# Altium project nrf52805_caaa_dcdc.PrjPCB
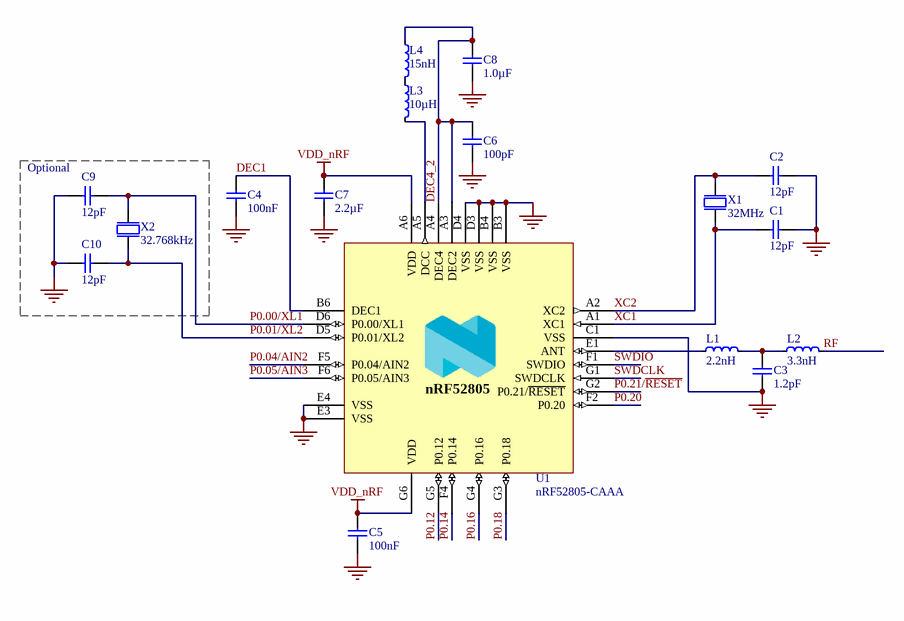
[diagram p0: nrf52805_caaa_dcdc.SchDoc]
1 sheet, 17 parts. Net scope: global (net labels, ports and power ports of the same name join across sheets).
Board file: nrf52805_caaa_dcdc.PcbDoc

## Sheet nrf52805_caaa_dcdc.SchDoc: nRF52805-CAAA Reference Layout (DCDC)
size A4; Revision: 1.0; SheetNumber: 1; SheetTotal: 1; DrawnBy: RUBR; DocumentSize: A4; PCAName: nRF52805-CAAA Reference Layout (DCDC)

### Parts
C1  12pF  [CAPC0603X03L_C]
C2  12pF  [CAPC0603X03L_C]
C3  1.2pF  [CAPC0603X03L_C]
C4  100nF  [CAPC0603X03L_C]
C5  100nF  [CAPC0603X03L_C]
C6  100pF  [CAPC0603X03L_C]
C7  2.2µF  [CAPC1005X04L]
C8  1.0µF  [CAPC1005X04L]
C9  12pF  [CAPC0603X03L_C]
C10  12pF  [CAPC0603X03L_C]
L1  2.2nH  [INDC0603X03L_C]
L2  3.3nH  [INDC0603X03L_C]
L3  10µH  [INDC1608X06L]
L4  15nH  [INDC1005X04L]
U1  nRF52805-CAAA  [BGA28C40P6X6_247X246X50]
X1  32MHz  [BT-XTAL_2016]
X2  32.768kHz  [XTAL_2012]

### Blocks framed on the sheet
Optional: C9 C10 X2

### Nets
GND: C1.1 C2.1 C3.1 C4.2 C5.2 C6.1 C7.2 C8.1 C9.1 C10.1 U1.B3(VSS) U1.B4(VSS) U1.C1(VSS) U1.D3(VSS) U1.D4(VSS) U1.E3(VSS) U1.E4(VSS) X1.2(GND) X1.4(GND)
VDD_nRF: C5.1 C7.1 U1.A6(VDD) U1.G6(VDD)
DEC1: C4.1 U1.B6(DEC1)
DEC4_2: C6.2 C8.2 L4.1 U1.A3(DEC2) U1.A4(DEC4)
P0.00/XL1: C9.2 U1.D6(P0.00/XL1) X2.1(inp)
P0.01/XL2: C10.2 U1.D5(P0.01/XL2) X2.2(out)
P0.04/AIN2: U1.F5(P0.04/AIN2)
P0.05/AIN3: U1.F6(P0.05/AIN3)
P0.12: U1.G5(P0.12)
P0.14: U1.F4(P0.14)
P0.16: U1.G4(P0.16)
P0.18: U1.G3(P0.18)
P0.20: U1.F2(P0.20)
P0.21/~{RESET}: U1.G2(P0.21/~{RESET})
RF: L2.2
SWDCLK: U1.G1(SWDCLK)
SWDIO: U1.F1(SWDIO)
XC1: C1.2 U1.A1(XC1) X1.1(inp)
XC2: C2.2 U1.A2(XC2) X1.3(out)
NetC3_2: C3.2 L1.2 L2.1
NetL1_1: L1.1 U1.E1(ANT)
NetL3_1: L3.1 L4.2
NetL3_2: L3.2 U1.A5(DCC)

### Notes on the sheet
- Title
- Size
- Date:
- A4
- Project Number
- Sheet         of
- Revision
- File:
- Drawn By:
- (in symbol nRF52805-CAAA) nRF52805

### Library data of the parts
C1 C2 C9 C10 = C0201-12p: Capacitor, NP0, ±2%; Part Number: C0201-12p; Manufacturer: *; Manufacturer Part Number: *; LatestRevisionDate: 2017-11-09; Pin Count: 2; Publisher: Nordic Semiconductor; Published: 2014-11-13; Value: 12pF; Footprint Doc: 0201
C3 = C0201-1.2p: Capacitor, NP0, ±5%; Part Number: C0201-1.2p; Manufacturer: *; Manufacturer Part Number: *; LatestRevisionDate: 2014-11-13; Pin Count: 2; Publisher: Nordic Semiconductor; Published: 2014-11-13; Value: 1.2pF; Footprint Doc: 0201
C4 C5 = C0201-100n: Capacitor, X5R, ±10%; Part Number: C0201-100n; Manufacturer: *; Manufacturer Part Number: *; LatestRevisionDate: 2017-11-09; Pin Count: 2; Publisher: Nordic Semiconductor; Published: 2014-11-13; Value: 100nF; Footprint Doc: 0201
C6 = C0201-100p: Capacitor, NP0, ±2%; Part Number: C0201-100p; Manufacturer: *; Manufacturer Part Number: *; LatestRevisionDate: 2017-11-09; Pin Count: 2; Publisher: Nordic Semiconductor; Published: 2014-11-13; Value: 100pF; Footprint Doc: 0201
C7 = C0402-2µ2: Capacitor, X5R, ±20%; Part Number: C0402-2µ2; Manufacturer: *; Manufacturer Part Number: *; LatestRevisionDate: 2006-06-02; Pin Count: 2; Publisher: Nordic Semiconductor; Published: 2009-05-08; Value: 2.2µF; Footprint Doc: 0402
C8 = C0402-1µ0: Capacitor, X5R, ±5%; Part Number: C0402-1µ0; Manufacturer: *; Manufacturer Part Number: *; LatestRevisionDate: 2016-08-22; Pin Count: 2; Publisher: Nordic Semiconductor; Published: 2009-05-08; Value: 1.0µF; Footprint Doc: 0402
L1 = L0201-2n2: High frequency chip inductor ±5%; Part Number: L0201-2n2; Manufacturer: *; Manufacturer Part Number: *; LatestRevisionDate: 2013-04-10; Pin Count: 2; Publisher: Nordic Semiconductor; Published: 2013-04-10; Value: 2.2nH; Footprint Doc: 0201
L2 = L0201-3n3: High frequency chip inductor ±5%; Part Number: L0201-3n3; Manufacturer: *; Manufacturer Part Number: *; LatestRevisionDate: 2013-04-10; Pin Count: 2; Publisher: Nordic Semiconductor; Published: 2013-04-10; Value: 3.3nH; Footprint Doc: 0201
L3 = L0603-10µ: Chip inductor, IDC,min = 50 mA, ±20%; Part Number: L0603-10µ; LatestRevisionDate: 2012-09-19; Pin Count: 2; Publisher: Nordic Semiconductor; Published: 2010-02-24; Value: 10µH; Footprint Doc: 0603
L4 = L0402-15n: High frequency chip inductor ±10%; Part Number: L0402-15n; LatestRevisionDate: 2012-09-19; Pin Count: 2; Publisher: Nordic Semiconductor; Published: 2010-07-12; Value: 15nH; Footprint Doc: 0402
U1 = nRF52805-CAAA: Multi-protocol Bluetooth Low Energy, IEEE 802.15.4, ANT and 2.4GHz proprietary system-on-chip; Manufacturer: Nordic Semiconductor; Part Number: nRF52805-CAAA; Manufacturer Part Number: nRF52805-CAAA; LatestRevisionDate: 2018-11-28; Pin Count: 28; Publisher: Nordic Semiconductor; Published: 2018-11-28; Value: nRF52805-CAAA; Footprint Doc: WLCSP-28
X1 = XTAL_SMD2016_32MHz_8pF_General: XTAL SMD 2016, 32MHz, Cl=8pF, Total Tol: ±40ppm; Part Number: XTAL_SMD2016_32MHz_8pF_General; Manufacturer: *; Manufacturer Part Number: *; LatestRevisionDate: 2016-08-19; Pin Count: 4; Publisher: Nordic Semiconductor; Published: 2016-08-19; Value: 32MHz; Footprint Doc: XTAL_2016
X2 = XTAL_SMD2012_32.768kHz_9pF_General: XTAL SMD 2012, 32.768kHz, Cl=9pF, Total Tol: ±50ppm; Part Number: XTAL_SMD2012_32.768kHz_9pF_General; Manufacturer: *; Manufacturer Part Number: *; LatestRevisionDate: 2017-01-11; Pin Count: 2; Publisher: Nordic Semiconductor; Published: 2016-08-19; Value: 32.768kHz; Footprint Doc: XTAL_2012